# Altium schematic sheet QCopterMV_FMC_Sch.SchDoc: QCopterMV-FMC
size 152 x 127 mm; Author: Hom; CompanyName: KitSprout; DrawnBy: Hom; Engineer: Hom; Organization: KitSprout; Revision: A; SheetNumber: 1; SheetTotal: 1; License: CC BY-SA 4.0; Version: 2.0; LibVersion: 2.7; PageSetup: Record=PageOptions|CenterHorizontal=True|CenterVertical=True|PrintScale=1.00|XCorrection=1.00|YCorrection=1.00|PrintKind=0|BorderSize=5000000|LeftOffset=0|BottomOffset=0|Orientation=2|PaperLength=1000|PaperWidth=1000|Scale=100|PaperSource=7|PrintQuality=-4|MediaType=1|DitherType=10|PaperKind=A4|PrintScaleMode=0
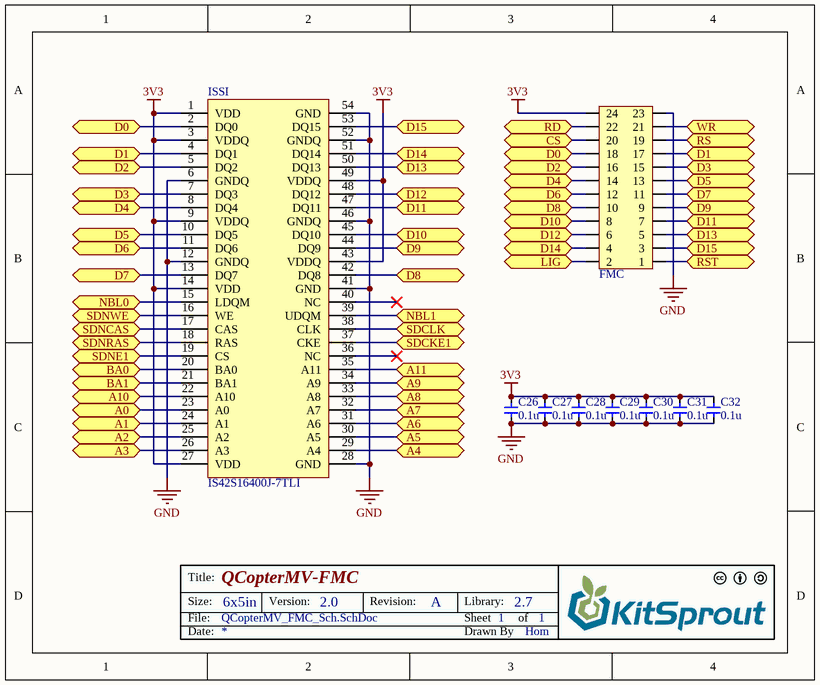
[diagram p0: QCopterMV_FMC_Sch.SchDoc]

## Parts
C26  value 0.1u  [CAP_0402]  (hidden comment: Cap_0402)
C27  value 0.1u  [CAP_0402]  (hidden comment: Cap_0402)
C28  value 0.1u  [CAP_0402]  (hidden comment: Cap_0402)
C29  value 0.1u  [CAP_0402]  (hidden comment: Cap_0402)
C30  value 0.1u  [CAP_0402]  (hidden comment: Cap_0402)
C31  value 0.1u  [CAP_0402]  (hidden comment: Cap_0402)
C32  value 0.1u  [CAP_0402]  (hidden comment: Cap_0402)
FMC  HDR2x12_1.27  [HDR2X12_1.27_180HF]  (value not drawn)
ISSI  IS42S16400J-7TLI  [TSOP_E400_P0.8_54]

## Ports
A0, A1, A2, A3, A4, A5, A6, A7, A8, A9, A10, A11, BA0, BA1, CS, D0, D1, D2, D3, D4, D5, D6, D7, D8, D9, D10, D11, D12, D13, D14, D15, LIG, NBL0, NBL1, RD, RS, RST, SDCKE1, SDCLK, SDNCAS, SDNE1, SDNRAS, SDNWE, WR

## Nets
3V3: C26.2 C27.2 C28.2 C29.2 C30.2 C31.2 C32.2 FMC.24 ISSI.1(VDD) ISSI.3(VDDQ) ISSI.9(VDDQ) ISSI.14(VDD) ISSI.27(VDD) ISSI.43(VDDQ) ISSI.49(VDDQ)
GND: C26.1 C27.1 C28.1 C29.1 C30.1 C31.1 C32.1 FMC.23 ISSI.6(GNDQ) ISSI.12(GNDQ) ISSI.28(GND) ISSI.41(GND) ISSI.46(GNDQ) ISSI.52(GNDQ) ISSI.54(GND)
A0: ISSI.23(A0) ; port A0
A1: ISSI.24(A1) ; port A1
A2: ISSI.25(A2) ; port A2
A3: ISSI.26(A3) ; port A3
A4: ISSI.29(A4) ; port A4
A5: ISSI.30(A5) ; port A5
A6: ISSI.31(A6) ; port A6
A7: ISSI.32(A7) ; port A7
A8: ISSI.33(A8) ; port A8
A9: ISSI.34(A9) ; port A9
A10: ISSI.22(A10) ; port A10
A11: ISSI.35(A11) ; port A11
BA0: ISSI.20(BA0) ; port BA0
BA1: ISSI.21(BA1) ; port BA1
CS: FMC.20 ; port CS
D0: FMC.18 ISSI.2(DQ0) ; port D0
D1: FMC.17 ISSI.4(DQ1) ; port D1
D2: FMC.16 ISSI.5(DQ2) ; port D2
D3: FMC.15 ISSI.7(DQ3) ; port D3
D4: FMC.14 ISSI.8(DQ4) ; port D4
D5: FMC.13 ISSI.10(DQ5) ; port D5
D6: FMC.12 ISSI.11(DQ6) ; port D6
D7: FMC.11 ISSI.13(DQ7) ; port D7
D8: FMC.10 ISSI.42(DQ8) ; port D8
D9: FMC.9 ISSI.44(DQ9) ; port D9
D10: FMC.8 ISSI.45(DQ10) ; port D10
D11: FMC.7 ISSI.47(DQ11) ; port D11
D12: FMC.6 ISSI.48(DQ12) ; port D12
D13: FMC.5 ISSI.50(DQ13) ; port D13
D14: FMC.4 ISSI.51(DQ14) ; port D14
D15: FMC.3 ISSI.53(DQ15) ; port D15
LIG: FMC.2 ; port LIG
NBL0: ISSI.15(LDQM) ; port NBL0
NBL1: ISSI.39(UDQM) ; port NBL1
RD: FMC.22 ; port RD
RS: FMC.19 ; port RS
RST: FMC.1 ; port RST
SDCKE1: ISSI.37(CKE) ; port SDCKE1
SDCLK: ISSI.38(CLK) ; port SDCLK
SDNCAS: ISSI.17(CAS) ; port SDNCAS
SDNE1: ISSI.19(CS) ; port SDNE1
SDNRAS: ISSI.18(RAS) ; port SDNRAS
SDNWE: ISSI.16(WE) ; port SDNWE
WR: FMC.21 ; port WR

Not connected (* = marked no-connect by the designer): ISSI 36(NC)* 40(NC)*

## Notes on the sheet
- Title:
- Size:
- Date:
- File:
- 6x5in
- Version:
- Revision:
- Sheet
- Drawn By
- Library:
- of

## Library data of the parts
C26-C32 = Cap_0402: Capacitor
FMC = HDR2x12_1.27: Header
ISSI = IS42S16400: SDRAM